# Altium schematic sheet LED_Module.SchDoc: LED_Module
size A4
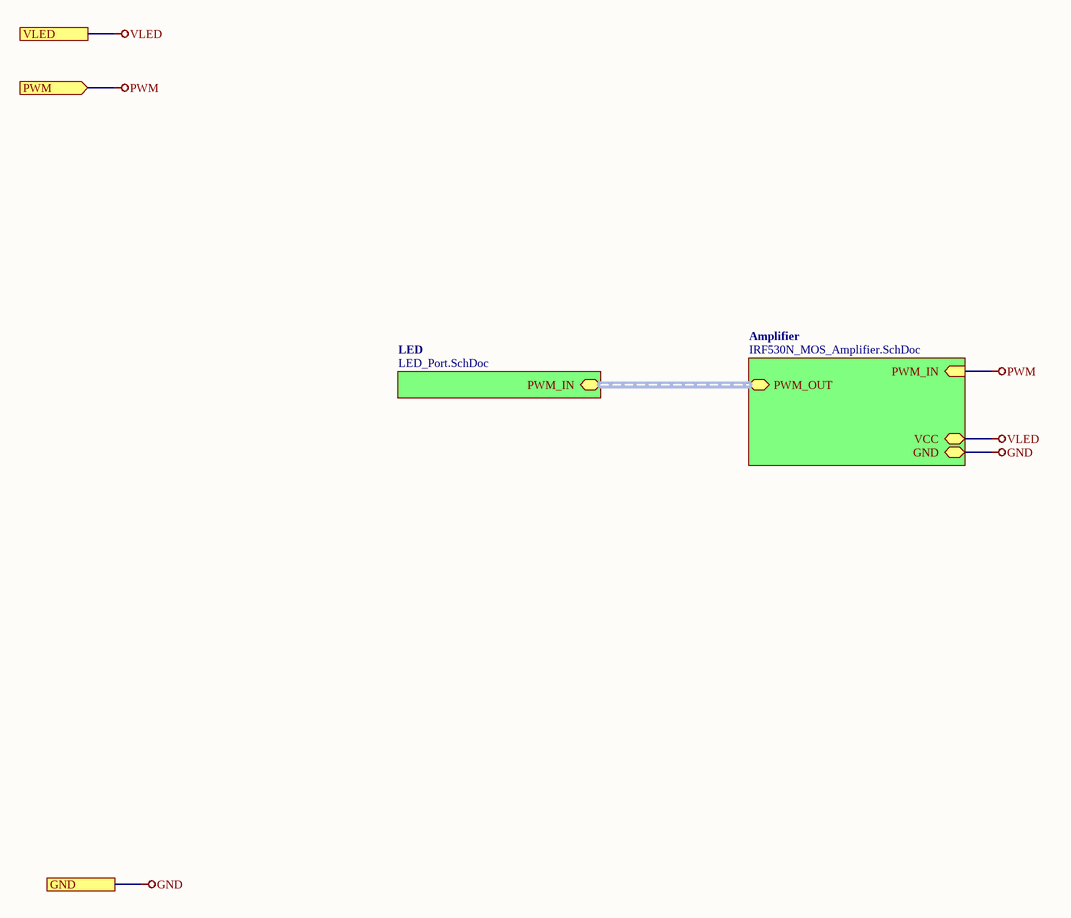
[diagram p0: LED_Module.SchDoc]

## Sub-sheets
Amplifier = IRF530N_MOS_Amplifier.SchDoc: GND, VCC, PWM_IN (in), PWM_OUT (harness PWM_LIGHT)
LED = LED_Port.SchDoc: PWM_IN (harness PWM_LIGHT)

## Ports
GND, PWM (in), VLED

## Nets
GND: port GND, sheet Amplifier/GND
PWM: port PWM, sheet Amplifier/PWM_IN
VLED: port VLED, sheet Amplifier/VCC

## Buses and harness runs
harness sheet Amplifier/PWM_OUT = sheet LED/PWM_IN